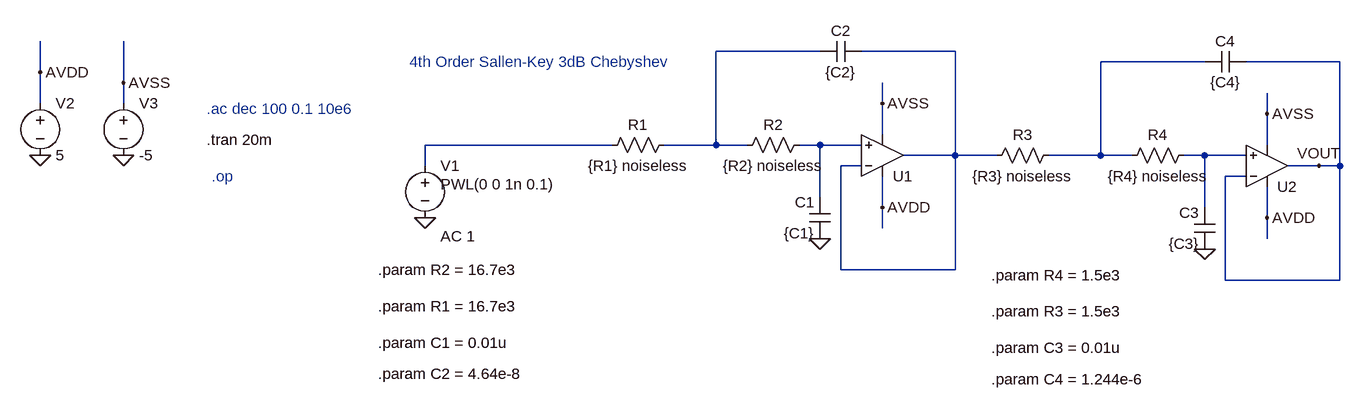
[diagram p0: schematic sallen_key_4th_order_Chebyshev.asc]
sallen_key_4th_order_Chebyshev.asc, the LTspice schematic file:
Version 4
SHEET 1 1280 856
WIRE 464 0 304 0
WIRE 672 0 528 0
WIRE 1056 16 896 16
WIRE 1264 16 1120 16
WIRE -736 32 -736 -16
WIRE -608 48 -608 -16
WIRE -736 80 -736 32
WIRE -608 80 -608 48
WIRE 560 80 560 48
WIRE 1152 96 1152 64
WIRE 560 128 560 80
WIRE 144 144 -144 144
WIRE 304 144 304 0
WIRE 304 144 224 144
WIRE 352 144 304 144
WIRE 464 144 432 144
WIRE 528 144 464 144
WIRE 1152 144 1152 96
WIRE 672 160 672 0
WIRE 672 160 592 160
WIRE 736 160 672 160
WIRE 896 160 896 16
WIRE 896 160 816 160
WIRE 944 160 896 160
WIRE 1056 160 1024 160
WIRE 1120 160 1056 160
WIRE -144 176 -144 144
WIRE 528 176 496 176
WIRE 1232 176 1184 176
WIRE 1264 176 1264 16
WIRE 1264 176 1232 176
WIRE 1120 192 1088 192
WIRE 464 224 464 144
WIRE 560 240 560 192
WIRE 1056 240 1056 160
WIRE 1152 256 1152 208
WIRE 560 272 560 240
WIRE 1152 288 1152 256
WIRE 496 336 496 176
WIRE 672 336 672 160
WIRE 672 336 496 336
WIRE 1088 352 1088 192
WIRE 1264 352 1264 176
WIRE 1264 352 1088 352
FLAG 464 288 0
FLAG -144 256 0
FLAG -736 160 0
FLAG -608 160 0
FLAG -736 32 AVDD
FLAG -608 48 AVSS
FLAG 560 80 AVSS
FLAG 560 240 AVDD
FLAG 1056 304 0
FLAG 1232 176 VOUT
FLAG 1152 96 AVSS
FLAG 1152 256 AVDD
DATAFLAG -48 144 ""
DATAFLAG 576 0 ""
DATAFLAG 1168 16 ""
SYMBOL Opamps\\UniversalOpamp2 560 160 M180
SYMATTR InstName U1
SYMBOL res 448 128 R90
WINDOW 0 0 56 VBottom 2
WINDOW 3 32 56 VTop 2
SYMATTR InstName R2
SYMATTR Value {R2} noiseless
SYMBOL res 240 128 R90
WINDOW 0 0 56 VBottom 2
WINDOW 3 32 56 VTop 2
SYMATTR InstName R1
SYMATTR Value {R1} noiseless
SYMBOL cap 528 -16 R90
WINDOW 0 0 32 VBottom 2
WINDOW 3 32 32 VTop 2
SYMATTR InstName C2
SYMATTR Value {C2}
SYMBOL cap 480 288 R180
WINDOW 0 24 56 Left 2
WINDOW 3 24 8 Left 2
SYMATTR InstName C1
SYMATTR Value {C1}
SYMBOL voltage -144 160 R0
WINDOW 123 24 124 Left 2
WINDOW 39 0 0 Left 0
WINDOW 3 24 44 Left 2
SYMATTR Value2 AC 1
SYMATTR Value PWL(0 0 1n 0.1)
SYMATTR InstName V1
SYMBOL voltage -736 64 R0
WINDOW 123 0 0 Left 0
WINDOW 39 0 0 Left 0
SYMATTR InstName V2
SYMATTR Value 5
SYMBOL voltage -608 64 R0
WINDOW 123 0 0 Left 0
WINDOW 39 0 0 Left 0
SYMATTR InstName V3
SYMATTR Value -5
SYMBOL Opamps\\UniversalOpamp2 1152 176 M180
SYMATTR InstName U2
SYMBOL res 1040 144 R90
WINDOW 0 0 56 VBottom 2
WINDOW 3 32 56 VTop 2
SYMATTR InstName R4
SYMATTR Value {R4} noiseless
SYMBOL res 832 144 R90
WINDOW 0 0 56 VBottom 2
WINDOW 3 32 56 VTop 2
SYMATTR InstName R3
SYMATTR Value {R3} noiseless
SYMBOL cap 1120 0 R90
WINDOW 0 0 32 VBottom 2
WINDOW 3 32 32 VTop 2
SYMATTR InstName C4
SYMATTR Value {C4}
SYMBOL cap 1072 304 R180
WINDOW 0 24 56 Left 2
WINDOW 3 24 8 Left 2
SYMATTR InstName C3
SYMATTR Value {C3}
TEXT -168 16 Left 2 ;4th Order Sallen-Key 3dB Chebyshev
TEXT -480 88 Left 2 ;.ac dec 100 0.1 10e6
TEXT -480 136 Left 2 !.tran 20m
TEXT -216 336 Left 2 !.param R2 = 16.7e3
TEXT -216 448 Left 2 !.param C1 = 0.01u
TEXT -216 496 Left 2 !.param C2 = 4.64e-8
TEXT -216 392 Left 2 !.param R1 = 16.7e3
TEXT -472 192 Left 2 ;.op
TEXT 728 344 Left 2 !.param R4 = 1.5e3
TEXT 728 456 Left 2 !.param C3 = 0.01u
TEXT 728 504 Left 2 !.param C4 = 1.244e-6
TEXT 728 400 Left 2 !.param R3 = 1.5e3

The netlist it stands for:
* sallen_key_4th_order_Chebyshev.asc
XU1 N005 N002 AVDD AVSS N002 level.2 Avol=1Meg GBW=10Meg Slew=10Meg ilimit=25m rail=0 Vos=0 phimargin=45 en=0 enk=0 in=0 ink=0 Rin=500Meg  ; pins IN+ IN- V+ V- OUT
R2 N005 N001 {R2} noiseless
R1 N001 N004 {R1} noiseless
C2 N002 N001 {C2}
C1 0 N005 {C1}
V1 N004 0 PWL(0 0 1n 0.1) AC 1
V2 AVDD 0 5
V3 AVSS 0 -5
XU2 N006 VOUT AVDD AVSS VOUT level.2 Avol=1Meg GBW=10Meg Slew=10Meg ilimit=25m rail=0 Vos=0 phimargin=45 en=0 enk=0 in=0 ink=0 Rin=500Meg  ; pins IN+ IN- V+ V- OUT
R4 N006 N003 {R4} noiseless
R3 N003 N002 {R3} noiseless
C4 VOUT N003 {C4}
C3 0 N006 {C3}
* 4th Order Sallen-Key 3dB Chebyshev
* .ac dec 100 0.1 10e6
.tran 20m
.param R2 = 16.7e3
.param C1 = 0.01u
.param C2 = 4.64e-8
.param R1 = 16.7e3
* .op
.param R4 = 1.5e3
.param C3 = 0.01u
.param C4 = 1.244e-6
.param R3 = 1.5e3
.lib UniversalOpamps2.sub
.backanno
.end